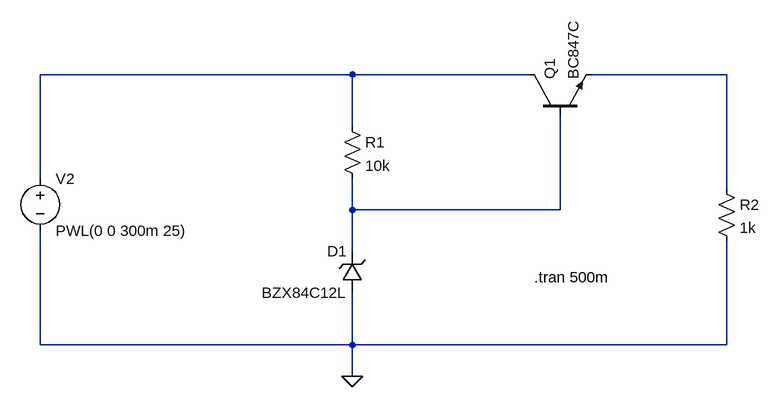
[diagram p0: schematic npn.asc]
npn.asc, the LTspice schematic file:
Version 4
SHEET 1 1060 688
WIRE 432 208 -48 208
WIRE 704 208 432 208
WIRE 1008 208 800 208
WIRE 432 288 432 208
WIRE -48 368 -48 208
WIRE 1008 384 1008 208
WIRE 432 416 432 368
WIRE 752 416 752 272
WIRE 752 416 432 416
WIRE 432 480 432 416
WIRE -48 624 -48 448
WIRE 432 624 432 544
WIRE 432 624 -48 624
WIRE 1008 624 1008 464
WIRE 1008 624 432 624
WIRE 432 672 432 624
FLAG 432 672 0
SYMBOL npn2 704 272 R270
SYMATTR InstName Q1
SYMATTR Value BC847C
SYMBOL Res 416 272 R0
SYMATTR InstName R1
SYMATTR Value 10k
SYMBOL zener 448 544 R180
WINDOW 0 24 64 Left 2
WINDOW 3 24 0 Left 2
SYMATTR InstName D1
SYMATTR Value BZX84C12L
SYMBOL Res 992 368 R0
SYMATTR InstName R2
SYMATTR Value 1k
SYMBOL Voltage -48 352 R0
SYMATTR InstName V2
SYMATTR Value PWL(0 0 300m 25)
TEXT 712 520 Left 2 !.tran 500m

The netlist it stands for:
* npn.asc
Q1 N001 N003 N002 0 BC847C
R1 N001 N003 10k
D1 0 N003 BZX84C12L
R2 N002 0 1k
V2 N001 0 PWL(0 0 300m 25)
.model D D
.lib standard.dio
.model NPN NPN
.model PNP PNP
.lib standard.bjt
.tran 500m
.backanno
.end